# EAGLE design piano555 (EAGLE 9.6.0)
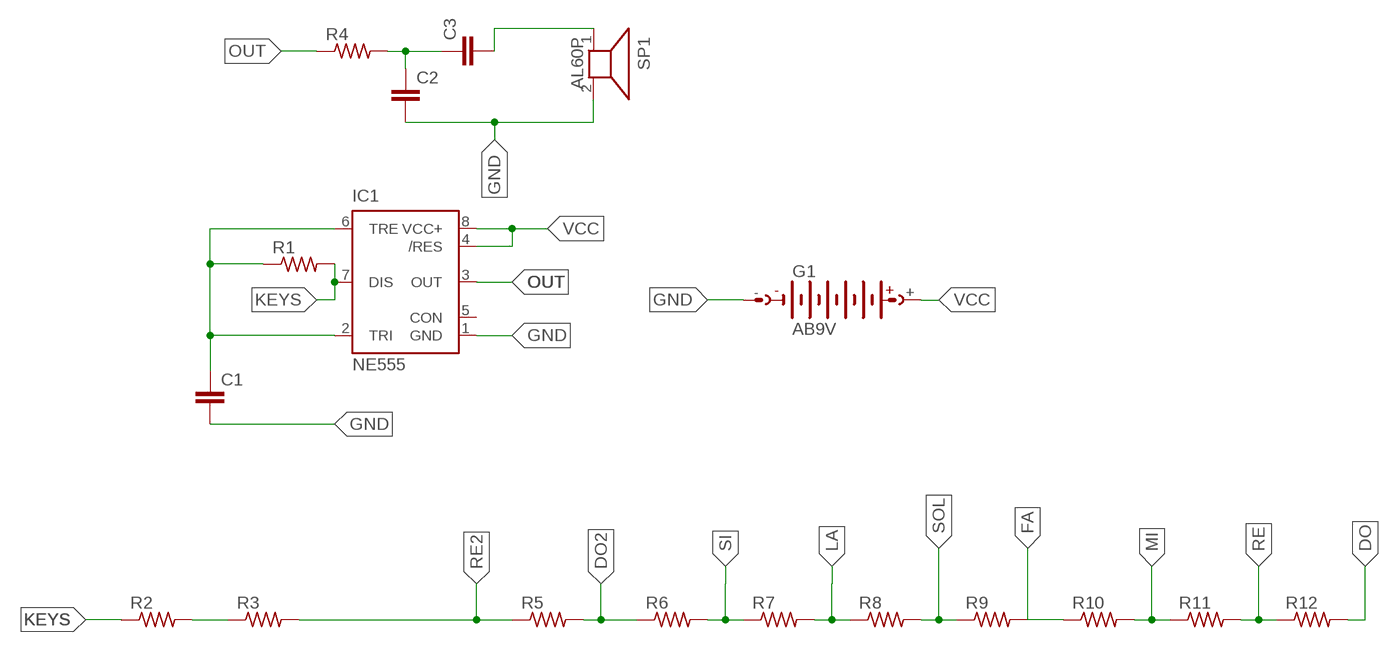
[diagram p0: schematic, sheet 1]

## Parts
C1  C-EU025-030X050  [C025-030X050]
C2  C-EU025-030X050  [C025-030X050]
C3  C-EU025-030X050  [C025-030X050]
G1  AB9V  [AB9V]
IC1  NE555  [DIL-08]
R1  R-US_0204/7  [0204/7]
R2  R-US_0204/7  [0204/7]
R3  R-US_0204/7  [0204/7]
R4  R-US_0204/7  [0204/7]
R5  R-US_0204/7  [0204/7]
R6  R-US_0204/7  [0204/7]
R7  R-US_0204/7  [0204/7]
R8  R-US_0204/7  [0204/7]
R9  R-US_0204/7  [0204/7]
R10  R-US_0204/7  [0204/7]
R11  R-US_0204/7  [0204/7]
R12  R-US_0204/7  [0204/7]
SP1  AL60P  [AL60P]

## Nets
DO: R12.2
DO2: R5.2 R6.1
FA: R9.2 R10.1
GND: C1.2 C2.2 G1.- IC1.1(GND) SP1.2
KEYS: IC1.7(DIS) R1.2 R2.1
LA: R7.2 R8.1
MI: R10.2 R11.1
N$1: C1.1 IC1.2(TRI) IC1.6(TRE) R1.1
N$2: R2.2 R3.1
N$4: C2.1 C3.1 R4.2
N$5: C3.2 SP1.1
OUT: IC1.3(OUT) R4.1
RE: R11.2 R12.1
RE2: R3.2 R5.1
SI: R6.2 R7.1
SOL: R8.2 R9.1
VCC: G1.+ IC1.4(/RES) IC1.8(VCC+)
Unconnected: IC1.5(CON)

## Library data of the parts
C1-C3 = rcl:C-EU: CAPACITOR, European symbol; SPICEPREFIX: C
G1 = battery:AB9V: 9-V BATTERY CLIP
IC1 = st-microelectronics:NE555: General purpose bipolar Timer; MF: Arrow Electronics; MPN: NE555N; OC_FARNELL: 1467742; OC_NEWARK: 89K1486
R1-R12 = rcl:R-US_: RESISTOR, American symbol; SPICEPREFIX: R
SP1 = buzzer:AL60P: SPEAKER Source: Buerklin; OC_FARNELL: unknown; OC_NEWARK: unknown

## Board
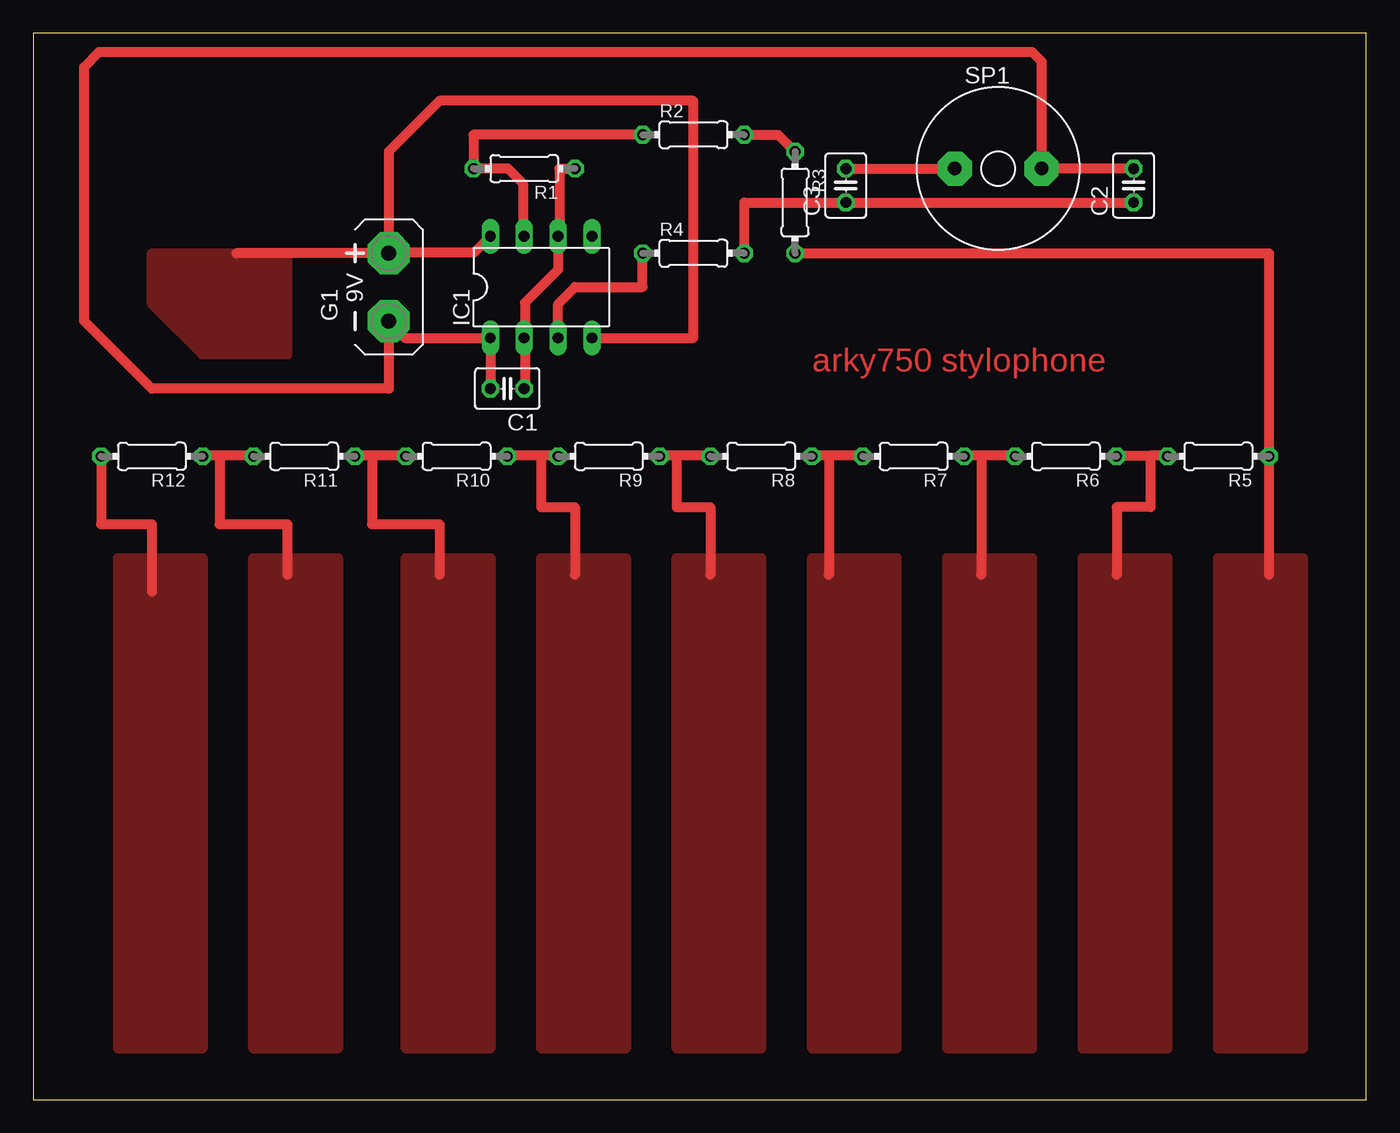
[diagram p1: board, top side]

Size 100 x 80 mm. Coordinates in mm from the lower left corner, seen from the top.
Outline: 0,0 100,0 100,80 0,80 0,0
Copper layers (1*16): Top 0.035mm / dielectric 1.5mm / Bottom 0.035mm
Design rules "default": minimum track width 6mil, minimum drill 0.35mm, track to track 6mil, track to pad 6mil, pad to pad 6mil, via to via 6mil, smd to smd 6mil, copper to edge 40mil, drill to drill 6mil, minimum pad ring 10mil, minimum via ring 8mil, stop-mask expansion 4mil, vias tented up to drill 0mil, thermal gap 10mil

### Footprints (pad centres in the part's own frame; a part is rotated, then mirrored left to right if it is on the bottom)
C025-030X050 = drill 0.813 octagon: 1 -1.27,0; 2 1.27,0
AB9V = drill 1.118 pad 3.15 octagon: + 0,2.54; - 0,-2.54
DIL-08 = drill 0.813 long: 1 -3.81,-3.81; 2 -1.27,-3.81; 3 1.27,-3.81; 4 3.81,-3.81; 5 3.81,3.81; 6 1.27,3.81; 7 -1.27,3.81; 8 -3.81,3.81
0204/7 = drill 0.813 octagon: 1 -3.81,0; 2 3.81,0
AL60P = drill 1.016 pad 2.54 octagon: 1 -3.251,0; 2 3.251,0

### Placement (x,y rotation side)
C1  35.56,53.34 180 top
C2  82.55,68.58 90 top
C3  60.96,68.58 90 top
G1  26.67,60.96 0 top
IC1  38.1,60.96 0 top
R1  36.83,69.85 180 top
R2  49.53,72.39 0 top
R3  57.15,67.31 270 top
R4  49.53,63.5 0 top
R5  88.9,48.26 180 top
R6  77.47,48.26 180 top
R7  66.04,48.26 180 top
R8  54.61,48.26 180 top
R9  43.18,48.26 180 top
R10  31.75,48.26 180 top
R11  20.32,48.26 180 top
R12  8.89,48.26 180 top
SP1  72.39,69.85 0 top

### Tracks (layer width: path | path; a pad name or v marks a point on that pad's centre or on a via)
DO
  Top 0.762: R12.2 5.08,43.18 8.89,43.18 8.89,38.1
  pour Top (isolate 0.254): 6.35,40.64 12.7,40.64 12.7,3.81 6.35,3.81
DO2
  Top 0.762: 83.82,48.31 85.04,48.31 R5.2 | 83.82,48.31 81.38,48.31 R6.1 | 83.82,48.31 83.82,44.45 81.28,44.45 81.28,39.37
  pour Top (isolate 0.254): 78.74,40.64 85.09,40.64 85.09,3.81 78.74,3.81
FA
  Top 0.762: 38.1,48.31 39.32,48.31 R9.2 | 38.1,48.31 35.66,48.31 R10.1 | 38.1,48.31 38.1,44.45 40.64,44.45 40.64,39.37
  pour Top (isolate 0.254): 38.1,40.64 44.45,40.64 44.45,3.81 38.1,3.81
GND
  Top 0.762: C1.2 IC1.1 27.89,57.15 26.67,58.37 G1.- 26.67,53.34 8.89,53.34 3.81,58.42 3.81,77.47 4.94,78.6 74.93,78.6 75.64,77.89 SP1.2 C2.2
KEYS
  Top 0.762: IC1.7 36.73,64.77 36.73,68.73 35.61,69.85 R1.2 33.02,72.39 R2.1
LA
  Top 0.762: 59.69,48.31 62.18,48.31 R7.2 | 59.69,48.31 58.52,48.31 R8.1 | 59.69,48.31 59.69,39.37
  pour Top (isolate 0.254): 58.42,40.64 64.77,40.64 64.77,3.81 58.42,3.81
MI
  Top 0.762: 25.4,48.31 27.89,48.31 R10.2 | 25.4,48.31 24.23,48.31 R11.1 | 25.4,48.31 25.4,43.18 30.48,43.18 30.48,39.37
  pour Top (isolate 0.254): 27.94,40.64 34.29,40.64 34.29,3.81 27.94,3.81
N$1
  Top 0.762: 36.88,57.15 36.88,53.34 C1.1 | R1.1 39.47,69.85 39.47,64.77 IC1.6 39.37,62.28 36.88,59.79 36.88,57.15 | 36.88,57.15 IC1.2
N$2
  Top 0.762: R2.2 55.88,72.39 R3.1
N$4
  Top 0.762: R4.2 53.34,67.31 C3.1 C2.1
N$5
  Top 0.762: C3.2 SP1.1
OUT
  Top 0.762: R4.1 45.72,60.96 40.64,60.96 39.37,59.69 IC1.3
RE
  Top 0.762: 13.97,48.31 16.46,48.31 R11.2 | 13.97,48.31 12.8,48.31 R12.1 | 13.97,48.31 13.97,43.18 19.05,43.18 19.05,39.37
  pour Top (isolate 0.254): 16.51,40.64 22.86,40.64 22.86,3.81 16.51,3.81
RE2
  Top 0.762: R3.2 92.71,63.5 R5.1 92.71,39.37
  pour Top (isolate 0.254): 88.9,40.64 95.25,40.64 95.25,3.81 88.9,3.81
SI
  Top 0.762: 71.12,48.31 73.61,48.31 R6.2 | 71.12,48.31 69.95,48.31 R7.1 | 71.12,48.31 71.12,39.37
  pour Top (isolate 0.254): 68.58,40.64 74.93,40.64 74.93,3.81 68.58,3.81
SOL
  Top 0.762: 48.26,48.31 50.75,48.31 R8.2 | 48.26,48.31 47.09,48.31 R9.1 | 48.26,48.31 48.26,44.45 50.8,44.45 50.8,39.37
  pour Top (isolate 0.254): 48.26,40.64 54.61,40.64 54.61,3.81 48.26,3.81
VCC
  Top 0.762: IC1.8 33.07,63.55 26.67,63.55 G1.+ | G1.+ 15.24,63.5 | IC1.4 49.53,57.15 49.53,74.93 30.48,74.93 26.67,71.12 G1.+
  pour Top: 10.16,63.5 19.05,63.5 19.05,55.88 12.7,55.88 8.89,59.69 8.89,63.5

### Text on the board
Top: arky750 stylophone